# Altium schematic sheet 5V_SYS_SUPPLY.SchDoc
size A3; SheetNumber: 3; SheetTotal: 12
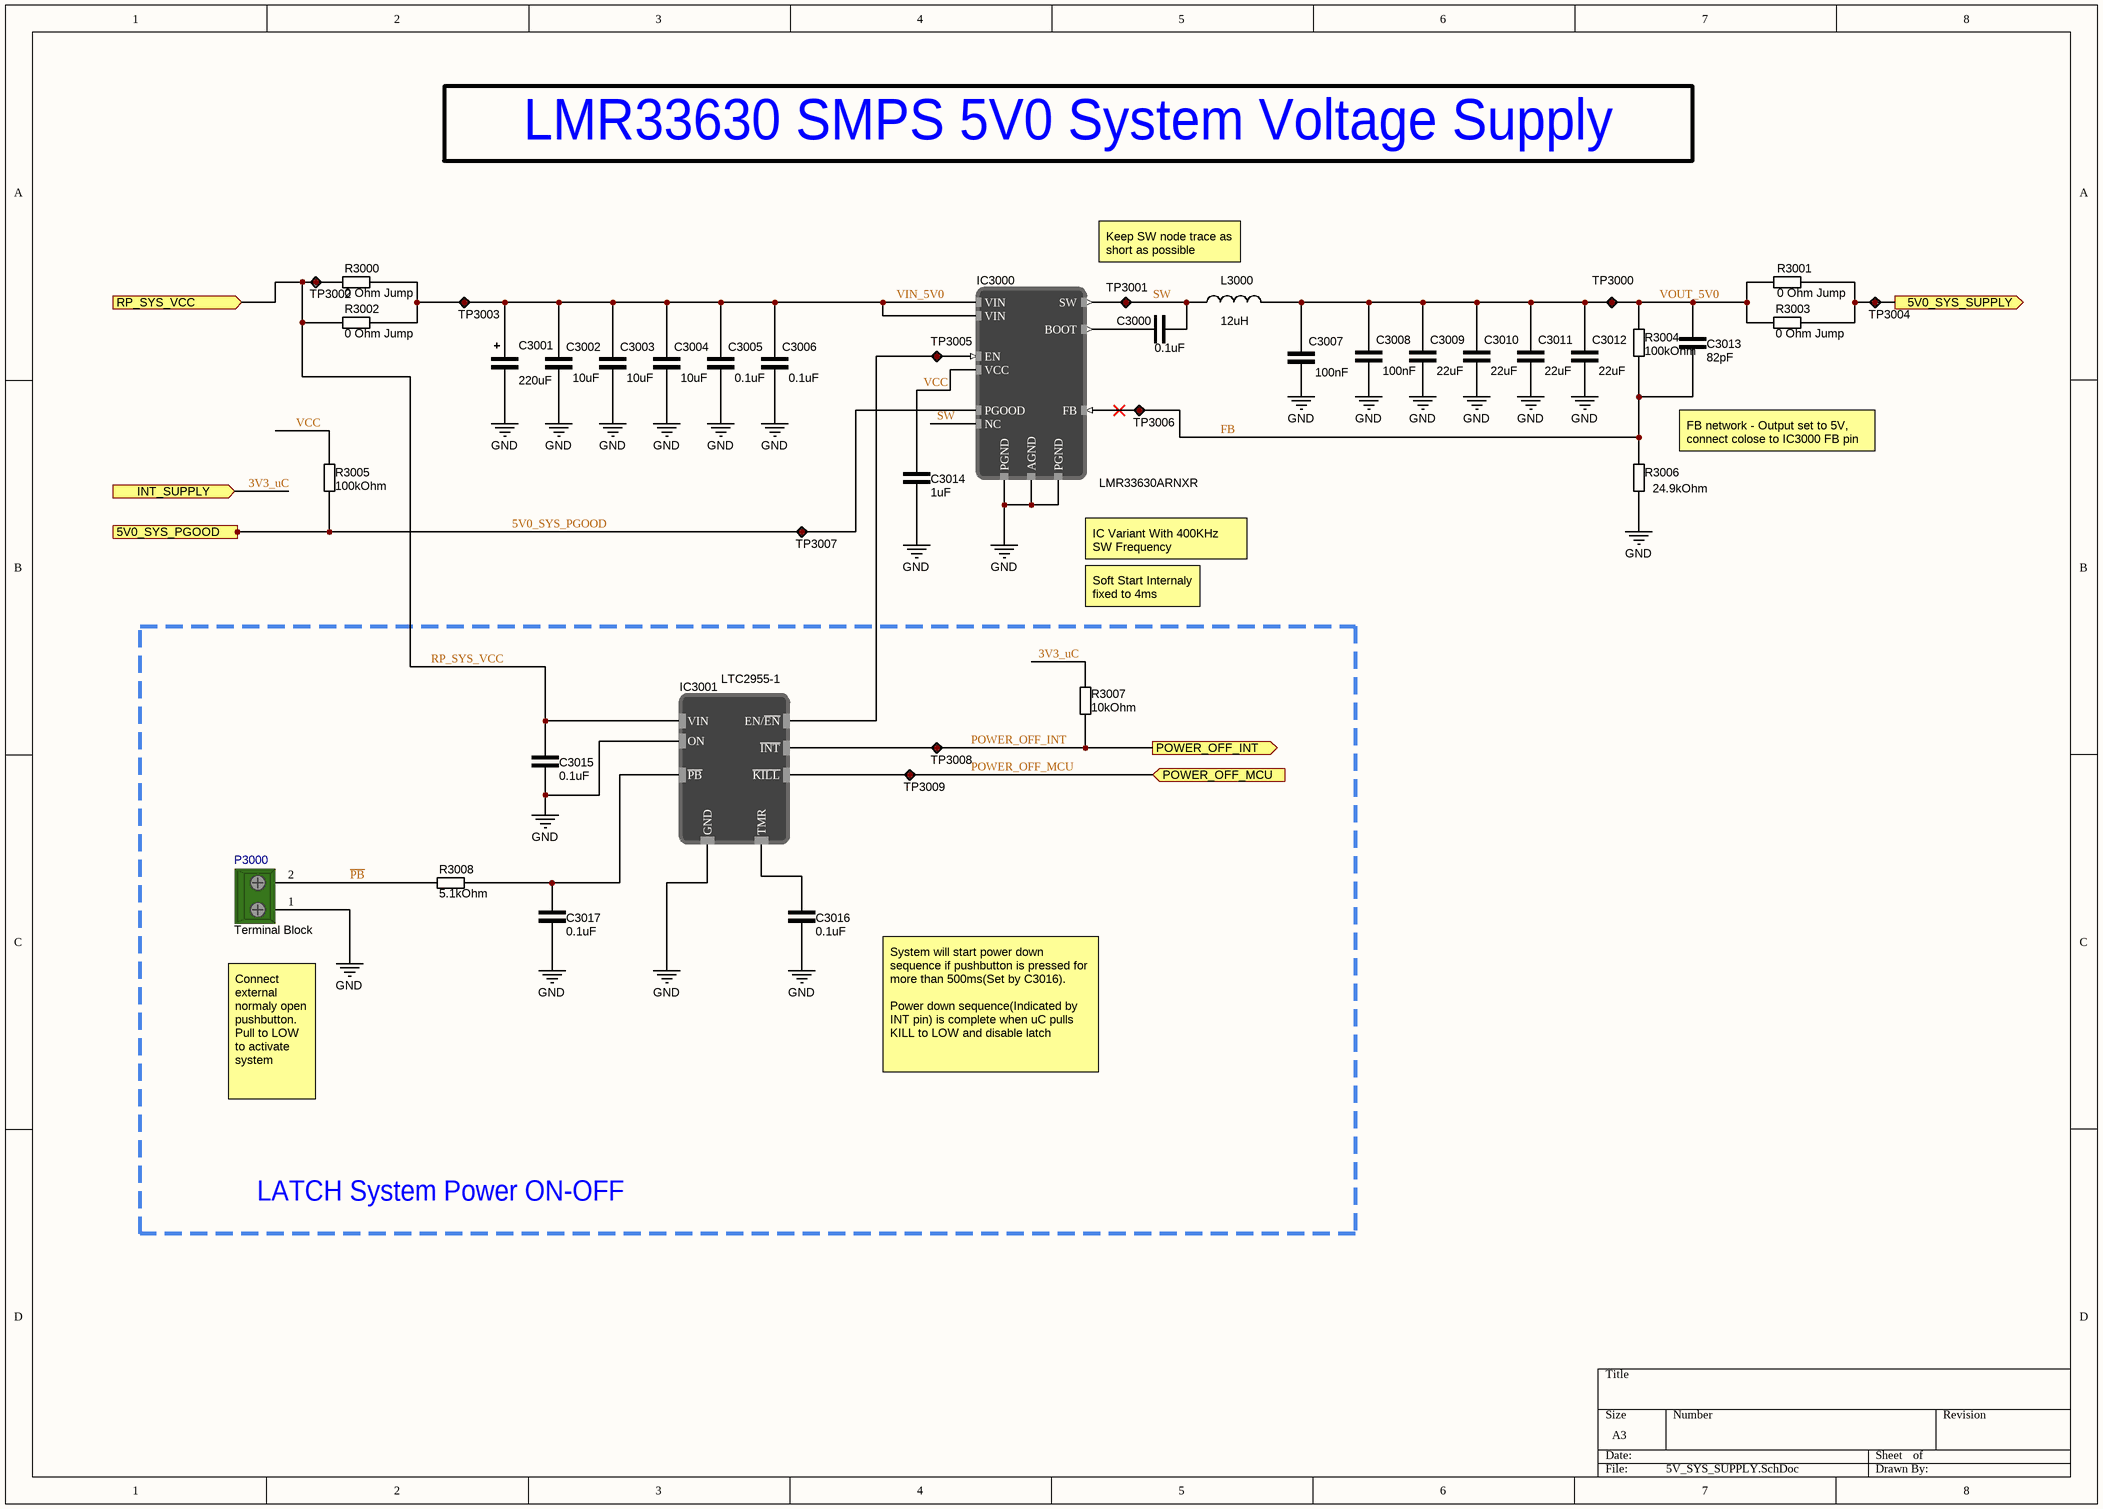
[diagram p0: 5V_SYS_SUPPLY.SchDoc]

## Parts
C3000  0.1uF  [CAP_0603]
C3001  220uF  [CAPAE109103X103M]
C3002  10uF  [CAP_1206]
C3003  10uF  [CAP_1206]
C3004  10uF  [CAP_1206]
C3005  0.1uF  [CAP_0603]
C3006  0.1uF  [CAP_0603]
C3007  100nF  [CAP_0603]
C3008  100nF  [CAP_0603]
C3009  22uF  [CAP_1206]
C3010  22uF  [CAP_1206]
C3011  22uF  [CAP_1206]
C3012  22uF  [CAP_1206]
C3013  82pF  [CAP_0603]
C3014  1uF  [CAP_0603]
C3015  0.1uF  [CAP_0603]
C3016  0.1uF  [CAP_0603]
C3017  0.1uF  [CAP_0603]
IC3000  LMR33630ARNXR  [VQFN-HR]
IC3001  LTC2955-1  [TSOP65P280X100-8N]
L3000  12uH  [INDM120120X80N]
P3000  Terminal Block  [TERM_BLOCK 5mm 2PIN]
R3000  0 Ohm Jump  [RES_0805]
R3001  0 Ohm Jump  [RES_1206]
R3002  0 Ohm Jump  [RES_0805]
R3003  0 Ohm Jump  [RES_1206]
R3004  100kOhm  [RES_0603]
R3005  100kOhm  [RES_0603]
R3006  24.9kOhm  [RES_0603]
R3007  10kOhm  [RES_0603]
R3008  5.1kOhm  [RES_0603]
TP3000  Test point  [TestPoint]  (value not drawn)
TP3001  Test point  [TestPoint]  (value not drawn)
TP3002  Test point  [TestPoint]  (value not drawn)
TP3003  Test point  [TestPoint]  (value not drawn)
TP3004  Test point  [TestPoint]  (value not drawn)
TP3005  Test point  [TestPoint]  (value not drawn)
TP3006  Test point  [TestPoint]  (value not drawn)
TP3007  Test point  [TestPoint]  (value not drawn)
TP3008  Test point  [TestPoint]  (value not drawn)
TP3009  Test point  [TestPoint]  (value not drawn)

## Ports
5V0_SYS_PGOOD (out, see 6DOF_CONTROLLER_Top[5A]), 5V0_SYS_SUPPLY (out, see 6DOF_CONTROLLER_Top[5A], 3V3_MCU_SUPPLY[1B], 3V3_SYS_SUPPLY[1B]), INT_SUPPLY (in, see 6DOF_CONTROLLER_Top[5A]), POWER_OFF_INT (out, see 6DOF_CONTROLLER_Top[5A]), POWER_OFF_MCU (in, see 6DOF_CONTROLLER_Top[5A]), RP_SYS_VCC (in, see 6DOF_CONTROLLER_Top[5A], Reverse_Protection[3A])

## Nets
GND: C3001.1 C3002.1 C3003.1 C3004.1 C3005.1 C3006.1 C3008.1 C3009.1 C3010.1 C3011.1 C3012.1 C3014.1 C3015.1 C3016.1 C3017.1 IC3000.1(PGND) IC3000.6(AGND) IC3000.11(PGND) IC3001.1(ON) IC3001.4(GND) P3000.1(pin1) R3006.1
3V3_uC: R3007.2 ; port INT_SUPPLY
5V0_SYS_PGOOD: IC3000.8(PGOOD) R3005.1 TP3007.1 ; port 5V0_SYS_PGOOD
5V0_SYS_SUPPLY: R3001.1 R3003.2 TP3004.1 ; port 5V0_SYS_SUPPLY
FB: C3013.1 IC3000.7(FB) R3004.1 R3006.2 TP3006.1
~{PB}: P3000.2(pin2) R3008.1
POWER_OFF_INT: IC3001.8(~{INT}) R3007.1 TP3008.1 ; port POWER_OFF_INT
POWER_OFF_MCU: IC3001.2(~{KILL}) TP3009.1 ; port POWER_OFF_MCU
RP_SYS_VCC: C3015.2 IC3001.6(VIN) R3000.1 R3002.1 TP3002.1 ; port RP_SYS_VCC
SW: C3000.2 IC3000.3(NC) IC3000.12(SW) L3000.1 TP3001.1
VCC: C3014.2 IC3000.5(VCC) R3005.2
VIN_5V0: C3001.2 C3002.2 C3003.2 C3004.2 C3005.2 C3006.2 IC3000.2(VIN) IC3000.10(VIN) R3000.2 R3002.2 TP3003.1
VOUT_5V0: C3007.2 C3008.2 C3009.2 C3010.2 C3011.2 C3012.2 C3013.2 L3000.2 R3001.2 R3003.1 R3004.2 TP3000.1
NetC3000_1: C3000.1 IC3000.4(BOOT)
NetC3016_2: C3016.2 IC3001.3(TMR)
NetC3017_2: C3017.2 IC3001.5(~{PB}) R3008.2
NetIC3000_9: IC3000.9(EN) IC3001.7(EN/~{EN}) TP3005.1

Not connected (* = marked no-connect by the designer): C3007 1

## Notes on the sheet
- LMR33630 SMPS 5V0 System Voltage Supply
- Keep SW node trace as short as possible
- FB network - Output set to 5V, connect colose to IC3000 FB pin
- (near IC3000) IC Variant With 400KHz SW Frequency
- Soft Start Internaly fixed to 4ms
- Connect external normaly open pushbutton.
  Pull to LOW to activate system
- System will start power down sequence if pushbutton is pressed for more than 500ms(Set by C3016).
  Power down sequence(Indicated by INT pin) is complete when uC pulls KILL to LOW and disable latch
- LATCH System Power ON-OFF
- Labels drawn without touching a wire or pin: GND

## Library data of the parts
C3000 C3005 C3006 C3015-C3017 = C000018: 0.1 µF ±10% 50V Ceramic Capacitor X7R 0603 (1608 Metric); ComponentLink1Description: DigiKey; ComponentLink1URL: https://www.digikey.com/en/products/detail/samsung-electro-mechanics/CL10B104KB8NNNC/3886658; DigiKey Part Number: 1276-1000-1-ND; capacitance: 0.1uF
C3001 = C000019: 220 µF 50 V Aluminum Electrolytic Capacitors Radial, Can - SMD 7000 Hrs @ 105°C; ComponentLink1Description: DigiKey; ComponentLink1URL: https://www.digikey.com/en/products/detail/nichicon/UCW1H221MNL1GS/2549783; DigiKey Part Number: 493-9426-1-ND; capacitance: 220uF
C3002-C3004 = C000017: 10 µF ±10% 50V Ceramic Capacitor X7R 1206 (3216 Metric); ComponentLink1Description: DigiKey; ComponentLink1URL: https://www.digikey.com/en/products/detail/samsung-electro-mechanics/CL31B106KBHNNNE/5961251; DigiKey Part Number: 1276-6767-1-ND; capacitance: 10uF
C3007 C3008 = C000007: 0.1 µF ±10% 25V Ceramic Capacitor X7R 0603 (1608 Metric); ComponentLink1Description: DigiKey; ComponentLink1URL: https://www.digikey.com/en/products/detail/kyocera-avx/06033C104K4T2A/8019250; DigiKey Part Number: 478-KAM15AR71E104KTCT-ND; capacitance: 100nF
C3009-C3012 = C000020: 22 µF ±10% 25V Ceramic Capacitor X5R 1206 (3216 Metric); ComponentLink1Description: DigiKey; ComponentLink1URL: https://www.digikey.com/en/products/detail/samsung-electro-mechanics/CL31A226KAHNNNE/3888705; DigiKey Part Number: 1276-3047-1-ND; capacitance: 22uF
C3013 = C000021: 82 pF ±1% 25V Ceramic Capacitor C0G, NP0 0603 (1608 Metric); ComponentLink1Description: DigiKey; ComponentLink1URL: https://www.digikey.com/en/products/detail/kyocera-avx/KGM15ACG1E820FT/1599315?s=N4IgjCBcoMxaBjKAzAhgGwM4FMA0IB7KAbXDBggF18AHAFyhAGU6AnASwDsBzEAX3xgALPBBJIaLHkIlwAVgCcAJiEB2ENRD1GLDj36CAbKPGSc%2BIpFIxlQ45u2RmbLrwEglABiEKTKDOYyViAAHEoABDQAYhq0DE4AqpzsdADyyACy2KiYAK6s2AYgALRKfpBsudKWpHIafA1AA; DigiKey Part Number: 478-KGM15ACG1E820FTCT-ND; capacitance: 82pF
C3014 = C000011: 1 µF ±10% 10V Ceramic Capacitor X7R 0603 (1608 Metric); ComponentLink1Description: DigiKey; ComponentLink1URL: https://www.digikey.com/en/products/detail/samsung-electro-mechanics/CL10B105KP8NNNC/3887604; DigiKey Part Number: 1276-1946-2-ND; capacitance: 1uF
IC3000 = LMR33630ARNXR: Buck Switching Regulator IC Positive Adjustable 1V 1 Output 3A 12-VFQFN; DigiKey Part Number: 296-49764-1-ND; ComponentLink1Description: DigiKey; ComponentLink1URL: https://www.digikey.com/en/products/detail/texas-instruments/LMR33630ARNXR/9356577; Mouser Part Number: 595-LMR33630ARNXR; ComponentLink2Description: Mouser; ComponentLink2URL: https://eu.mouser.com/ProductDetail/Texas-Instruments/LMR33630ARNXR?qs=55YtniHzbhBobt6bGtLStw%3D%3D
IC3001 = LTC2955-1: Power Supply Controller Push Button, On/Off Controller TSOT-23-8; DigiKey Part Number: 505-LTC2955CTS8-1#TRMPBFCT-ND; ComponentLink1Description: DigiKey; ComponentLink1URL: https://www.digikey.com/en/products/detail/analog-devices-inc/LTC2955CTS8-1-TRMPBF/3065178; Mouser Part Number: 584-C2955CTS8-1TMPF; ComponentLink2Description: Mouser; ComponentLink2URL: https://eu.mouser.com/ProductDetail/Analog-Devices/LTC2955CTS8-1TRMPBF?qs=hVkxg5c3xu%252B6Fq1Ir3bkGg%3D%3D
L3000 = L000007: FIXED IND 12UH 5.9A 24 MOHM SMD; inductance: 12uH; DigiKey Part Number: 732-1224-1-ND; ComponentLink1Description: DigiKey; ComponentLink1URL: https://www.digikey.com/en/products/detail/w%C3%BCrth-elektronik/744770112/1638629
P3000 = 00000001: Terminal block 90 deg 5mm 2PIN; ComponentLink1Description: DigiKey; ComponentLink1URL: https://www.digikey.com/en/products/detail/adam-tech/EB20-02-C/9831508; DigiKey part number: 2057-EB20-02-C-ND
R3000 R3002 = R000011: 0 Ohms Jumper Chip Resistor 0805 (2012 Metric) Automotive AEC-Q200 Thick Film; ComponentLink1Description: DigiKey; ComponentLink1URL: https://www.digikey.com/en/products/detail/panasonic-electronic-components/ERJ-6GEY0R00V/78163; resistance: 0 Ohm Jump; DigiKey Part Number: P0.0ACT-ND
R3001 R3003 = R000012: 0 Ohms Jumper Chip Resistor 1206 (3216 Metric) Automotive AEC-Q200 Thick Film; ComponentLink1Description: DigiKey; ComponentLink1URL: https://www.digikey.com/en/products/detail/stackpole-electronics-inc/RMCF1206ZT0R00/1756906; resistance: 0 Ohm Jump; DigiKey Part Number: RMCF1206ZT0R00CT-ND
R3004 R3005 = R000006: 100 kOhms ±1% 0.1W, 1/10W Chip Resistor 0603 (1608 Metric) Automotive AEC-Q200 Thick Film; resistance: 100kOhm; ComponentLink1Description: DigiKey; ComponentLink1URL: https://www.digikey.com/en/products/detail/stackpole-electronics-inc/RMCF0603FG100K/1713543; DigiKey Part Number: RMCF0603FG100KCT-ND
R3006 = R000017: 24.9 kOhms ±1% 0.1W, 1/10W Chip Resistor 0603 (1608 Metric) Automotive AEC-Q200 Thick Film; ComponentLink1Description: DigiKey; ComponentLink1URL: https://www.digikey.com/en/products/detail/panasonic-electronic-components/ERJ-3EKF2492V/196236; resistance: 24.9kOhm; DigiKey Part Number: P24.9KHCT-ND
R3007 = R000001: 10 kOhms ±1% 0.125W, 1/8W Chip Resistor 0603 (1608 Metric) Anti-Sulfur Thin Film; resistance: 10kOhm; ComponentLink1Description: DigiKey; ComponentLink1URL: https://www.digikey.com/en/products/detail/vishay-beyschlag-draloric-bc-components/MCT06030C1002FP500/1850440; DigiKey Part Number: MCT0603-10.0K-CFCT-ND
R3008 = R000013: 5.1 kOhms ±1% 0.1W, 1/10W Chip Resistor 0603 (1608 Metric) Moisture Resistant Thick Film; ComponentLink1Description: DigiKey; ComponentLink1URL: https://www.digikey.com/en/products/detail/yageo/RC0603FR-075K1L/727268; resistance: 5.1kOhm; DigiKey Part Number: 311-5.10KHRCT-ND
TP3000-TP3009 = TP002: Test point 1mm